# EAGLE design Flight Computer (EAGLE 6.4)
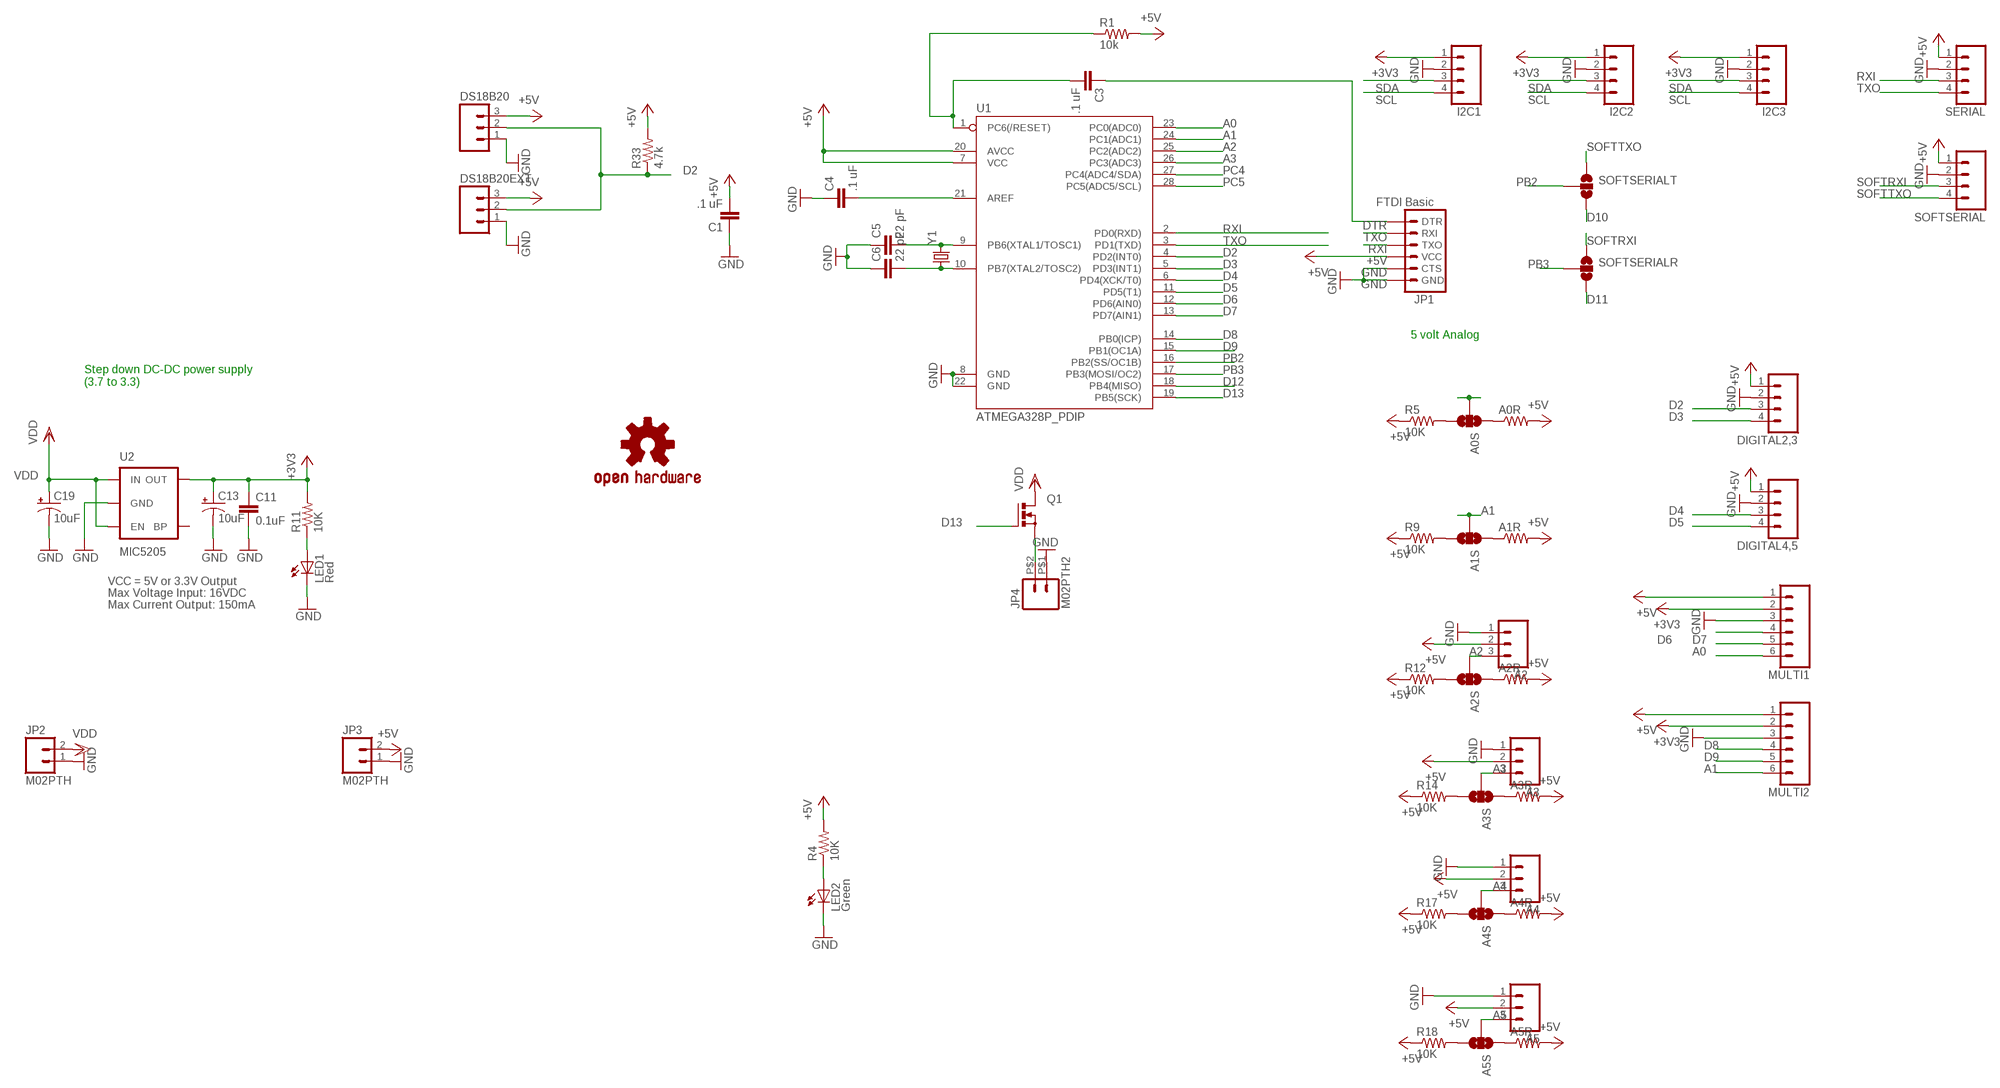
[diagram p0: schematic, sheet 1]

## Parts
A0R  RESISTORAXIAL-0.3  [AXIAL-0.3]
A0S  SOLDERJUMPER_2WAYPASTE2&3  [SJ_3_PASTE2&3]
A1R  RESISTORAXIAL-0.3  [AXIAL-0.3]
A1S  SOLDERJUMPER_2WAYPASTE2&3  [SJ_3_PASTE2&3]
A2  M03POLAR  [MOLEX-1X3]
A2R  RESISTORAXIAL-0.3  [AXIAL-0.3]
A2S  SOLDERJUMPER_2WAYPASTE2&3  [SJ_3_PASTE2&3]
A3  M03POLAR  [MOLEX-1X3]
A3R  RESISTORAXIAL-0.3  [AXIAL-0.3]
A3S  SOLDERJUMPER_2WAYPASTE2&3  [SJ_3_PASTE2&3]
A4  M03POLAR  [MOLEX-1X3]
A4R  RESISTORAXIAL-0.3  [AXIAL-0.3]
A4S  SOLDERJUMPER_2WAYPASTE2&3  [SJ_3_PASTE2&3]
A5  M03POLAR  [MOLEX-1X3]
A5R  RESISTORAXIAL-0.3  [AXIAL-0.3]
A5S  SOLDERJUMPER_2WAYPASTE2&3  [SJ_3_PASTE2&3]
C1  .1 uF  CAP1206  [1206]
C3  .1 uF  CAP1206  [1206]
C4  .1 uF  CAP1206  [1206]
C5  22 pF  CAPPTH1  [CAP-PTH-5MM]
C6  22 pF  CAPPTH1  [CAP-PTH-5MM]
C11  0.1uF  CAP1206  [1206]
C13  10uF  CAP_POL1206  [EIA3216]
C19  10uF  CAP_POL1206  [EIA3216]
DIGITAL2,3  M04POLAR  [MOLEX-1X4]
DIGITAL4,5  M04POLAR  [MOLEX-1X4]
DS18B20  M03PTH  [1X03]
DS18B20EXT  M03POLAR  [MOLEX-1X3]
I2C1  M04POLAR  [MOLEX-1X4]
I2C2  M04POLAR  [MOLEX-1X4]
I2C3  M04POLAR  [MOLEX-1X4]
JP1  FTDI Basic  ARDUINO_SERIAL_PROGRAMPTH  [1X06]
JP2  M02PTH  [1X02]
JP3  M02PTH  [1X02]
JP4  M02PTH2  [1X02_BIG]
LED1  Red  LED0603  [LED-0603]
LED2  Green  LED0603  [LED-0603]
LOGO1  OSHW-LOGOL  [OSHW-LOGO-L]
MULTI1  M06POLAR  [MOLEX-1X6]
MULTI2  M06POLAR  [MOLEX-1X6]
Q1  PMOSFET_NTO220BV  [TO220BV]
R1  10k  RESISTOR1206  [1206]
R4  10K  RESISTOR1206  [1206]
R5  10K  RESISTOR1206  [1206]
R9  10K  RESISTOR1206  [1206]
R11  10K  RESISTOR1206  [1206]
R12  10K  RESISTOR1206  [1206]
R14  10K  RESISTOR1206  [1206]
R17  10K  RESISTOR1206  [1206]
R18  10K  RESISTOR1206  [1206]
R33  4.7k  RESISTOR1206  [1206]
SERIAL  M04POLAR  [MOLEX-1X4]
SOFTSERIAL  M04POLAR  [MOLEX-1X4]
SOFTSERIALR  SOLDERJUMPER_2WAYPASTE2&3  [SJ_3_PASTE2&3]
SOFTSERIALT  SOLDERJUMPER_2WAYPASTE2&3  [SJ_3_PASTE2&3]
U1  ATMEGA328P_PDIP  [DIL28-3]
U2  MIC5205  V_REG_LDOSMD  [SOT23-5]
Y1  CRYSTALHC49UV  [HC49U-V]

## Nets
+3V3: C11.1 C13.A(+) I2C1.1 I2C2.1 I2C3.1 MULTI1.2 MULTI2.2 R11.2 U2.5(OUT)
+5V: A0R.P$2 A1R.P$2 A2.2 A2R.P$2 A3.2 A3R.P$2 A4.2 A4R.P$2 A5.2 A5R.P$2 C1.2 DIGITAL2,3.1 DIGITAL4,5.1 DS18B20.3 DS18B20EXT.3 JP1.4(VCC) JP3.2 MULTI1.1 MULTI2.1 R1.2 R4.2 R5.1 R9.1 R12.1 R14.1 R17.1 R18.1 R33.2 SERIAL.1 SOFTSERIAL.1 U1.7(VCC) U1.20(AVCC)
A0: A0S.2 MULTI1.6 U1.23(PC0(ADC0))
A1: A1S.2 MULTI2.6 U1.24(PC1(ADC1))
A2: A2.3 A2S.2 U1.25(PC2(ADC2))
A3: A3.3 A3S.2 U1.26(PC3(ADC3))
A4: A4.3 A4S.2
A5: A5.3 A5S.2
D2: DIGITAL2,3.3 DS18B20.2 DS18B20EXT.2 R33.1 U1.4(PD2(INT0))
D3: DIGITAL2,3.4 U1.5(PD3(INT1))
D4: DIGITAL4,5.3 U1.6(PD4(XCK/T0))
D5: DIGITAL4,5.4 U1.11(PD5(T1))
D6: MULTI1.4 U1.12(PD6(AIN0))
D7: MULTI1.5 U1.13(PD7(AIN1))
D8: MULTI2.4 U1.14(PB0(ICP))
D9: MULTI2.5 U1.15(PB1(OC1A))
D10: SOFTSERIALT.3
D11: SOFTSERIALR.3
D12: U1.18(PB4(MISO))
D13: Q1.G U1.19(PB5(SCK))
DTR: C3.1 JP1.1(DTR)
GND [vcc]: A2.1 A3.1 A4.1 A5.1 C1.1 C4.1 C5.1 C6.1 C11.2 C13.C(-) C19.C(-) DIGITAL2,3.2 DIGITAL4,5.2 DS18B20.1 DS18B20EXT.1 I2C1.2 I2C2.2 I2C3.2 JP1.5(CTS) JP1.6(GND) JP2.1 JP3.1 JP4.P$1 LED1.C LED2.C MULTI1.3 MULTI2.3 SERIAL.2 SOFTSERIAL.2 U1.8(GND) U1.22(GND) U2.2(GND)
N$1: C5.2 U1.9(PB6(XTAL1/TOSC1)) Y1.2
N$2: C6.2 U1.10(PB7(XTAL2/TOSC2)) Y1.1
N$3: LED2.A R4.1
N$4: A0S.3 R5.2
N$5: C4.2 U1.21(AREF)
N$6: JP4.P$2 Q1.S
N$7: C3.2 R1.1 U1.1(PC6(/RESET))
N$10: A1S.3 R9.2
N$12: A2S.3 R12.2
N$14: A3S.3 R14.2
N$17: A4S.3 R17.2
N$18: A5S.3 R18.2
N$20: A5R.P$1 A5S.1
N$23: A4R.P$1 A4S.1
N$24: A3R.P$1 A3S.1
N$27: A2R.P$1 A2S.1
N$29: A1R.P$1 A1S.1
N$30: A0R.P$1 A0S.1
N$38: LED1.A R11.1
PB2: SOFTSERIALT.2 U1.16(PB2(SS/OC1B))
PB3: SOFTSERIALR.2 U1.17(PB3(MOSI/OC2))
PC4: U1.27(PC4(ADC4/SDA))
PC5: U1.28(PC5(ADC5/SCL))
RXI: JP1.3(TXO) SERIAL.3 U1.2(PD0(RXD))
SCL: I2C1.4 I2C2.4 I2C3.4
SDA: I2C1.3 I2C2.3 I2C3.3
SOFTRXI: SOFTSERIAL.3 SOFTSERIALR.1
SOFTTXO: SOFTSERIAL.4 SOFTSERIALT.1
TXO: JP1.2(RXI) SERIAL.4 U1.3(PD1(TXD))
VDD: C19.A(+) JP2.2 Q1.D U2.1(IN) U2.3(EN)
Unconnected: U2.4(BP)

## Notes on the sheet
- 5 volt Analog
- Step down DC-DC power supply
  (3.7 to 3.3)
- VCC = 5V or 3.3V Output
- Max Voltage Input: 16VDC
- Max Current Output: 150mA

## Library data of the parts
A0R A1R A2R A3R A4R A5R R1 R5 R9 R12 R14 R17 R18 R33 = SparkFun-Passives:RESISTOR: Resistor Basic schematic elements and footprints for 0603, 1206, and PTH resistors.
A0S A1S A2S A3S A4S A5S SOFTSERIALR SOFTSERIALT = SparkFun:SOLDERJUMPER_2WAY: Solder Jumper 2 way solder jumper
A2-A5 DS18B20 DS18B20EXT = SparkFun-Connectors:M03: Header 3 Standard 3-pin 0.1" header. Use with straight break away headers (SKU : PRT-00116), right angle break away headers (PRT-00553), swiss pins (PRT-00743), machine pins (PRT-00117), and female headers (PRT-00115). Molex polarized connector foot print use with SKU : PRT-08232 with associated crimp pins and housings.
C1 C3-C6 = SparkFun-Passives:CAP: Capacitor Standard 0603 ceramic capacitor, and 0.1" leaded capacitor.
C11 = SparkFun:CAP: Capacitor Standard 0603 ceramic capacitor, and 0.1" leaded capacitor.
C13 C19 = SparkFun:CAP_POL: Capacitor Polarized These are standard SMD and PTH capacitors. Normally 10uF, 47uF, and 100uF in electrolytic and tantalum varieties. Always verify the external diameter of the through hole cap, it varies with capacity, voltage, and manufacturer. The EIA devices should be standard.
DIGITAL2,3 DIGITAL4,5 I2C1-I2C3 SERIAL SOFTSERIAL = SparkFun-Connectors:M04: Header 4 Standard 4-pin 0.1" header. Use with straight break away headers (SKU : PRT-00116), right angle break away headers (PRT-00553), swiss pins (PRT-00743), machine pins (PRT-00117), and female headers (PRT-00115). Molex polarized connector foot print use with SKU : PRT-08231 with associated crimp pins and housings. 1MM SMD Version SKU: PRT-10208
JP1 = SparkFun:ARDUINO_SERIAL_PROGRAM
JP2-JP4 = SparkFun-Connectors:M02: Standard 2-pin 0.1" header. Use with - straight break away headers ( PRT-00116) - right angle break away headers (PRT-00553) - swiss pins (PRT-00743) - machine pins (PRT-00117) - female headers (PRT-00115) Molex polarized connector foot print use with: PRT-08233 with associated crimp pins and housings. 2.54_SCREWTERM for use with PRT-10571. 3.5mm Screw Terminal footprints for PRT-08084 5mm Screw Terminal footprints for use with PRT-08433
LED1 LED2 = SparkFun:LED: LEDs Standard schematic elements and footprints for 5mm, 3mm, 1206, and 0603 sized LEDs. 5mm - Spark Fun Electronics SKU : COM-00529 (and others)
LOGO1 = SparkFun-Aesthetics:OSHW-LOGO: Open Source Hardware Logo This logo indicates the piece of hardware it is found on incorporates a OSHW license and/or adheres to the definition of open source hardware found here: http://freedomdefined.org/OSHW
MULTI1 MULTI2 = SparkFun-Connectors:M06: Header 6 Standard 6-pin 0.1" header. Use with straight break away headers (SKU : PRT-00116), right angle break away headers (PRT-00553), swiss pins (PRT-00743), machine pins (PRT-00117), and female headers (PRT-00115). Molex polarized connector foot print use with SKU : PRT-08094 with associated crimp pins and housings. NOTES ON THE VARIANTS LOCK and LOCK_LONGPADS... This footprint was designed to help hold the alignment of a through-hole component (i.e. 6-pin header) while soldering it into place. You may notice that each hole has been shifted either up or down by 0.005 of an inch from it's more standard position (which is a perfectly straight line). This slight alteration caused the pins (the squares in the middle) to touch the edges of the holes. Because they are alternating, it causes a "brace" to hold the component in place. 0.005 has proven to be the perfect amount of "off-center" position when using our standard breakaway headers. Although looks a little odd when you look at the bare footprint, once you have a header in there, the alteration is very hard to notice. Also,if you push a header all the way into place, it is covered up entirely on the bottom side. This idea of altering the position of holes to aid alignment will be further integrated into the Sparkfun Library for other footprints. It can help hold any component with 3 or more connection pins.
Q1 = transistor-power:PMOSFET_N: Power MOSFET N-Channel
R4 R11 = SparkFun:RESISTOR: Resistor Basic schematic elements and footprints for 0603, 1206, and PTH resistors.
U1 = SparkFun-DigitalIC:ATMEGA328P_PDIP: uC used in the Arduino 32kb flash, 1k EEPROM, 2k SRAM This is the through-hole version of this chip.
U2 = SparkFun:V_REG_LDO: Voltage Regulator LDO Standard 150mA LDO voltage regulator in SOT-23 layout. Micrel part MIC5205. BP (by-pass) pin is used to lower output noise with 470pF cap.
Y1 = SparkFun-FreqCtrl:CRYSTAL: Various standard crystals. Proven footprints. Spark Fun Electronics SKU : COM-00534

## Net classes
1 vcc: width 0.254 mm

## Board
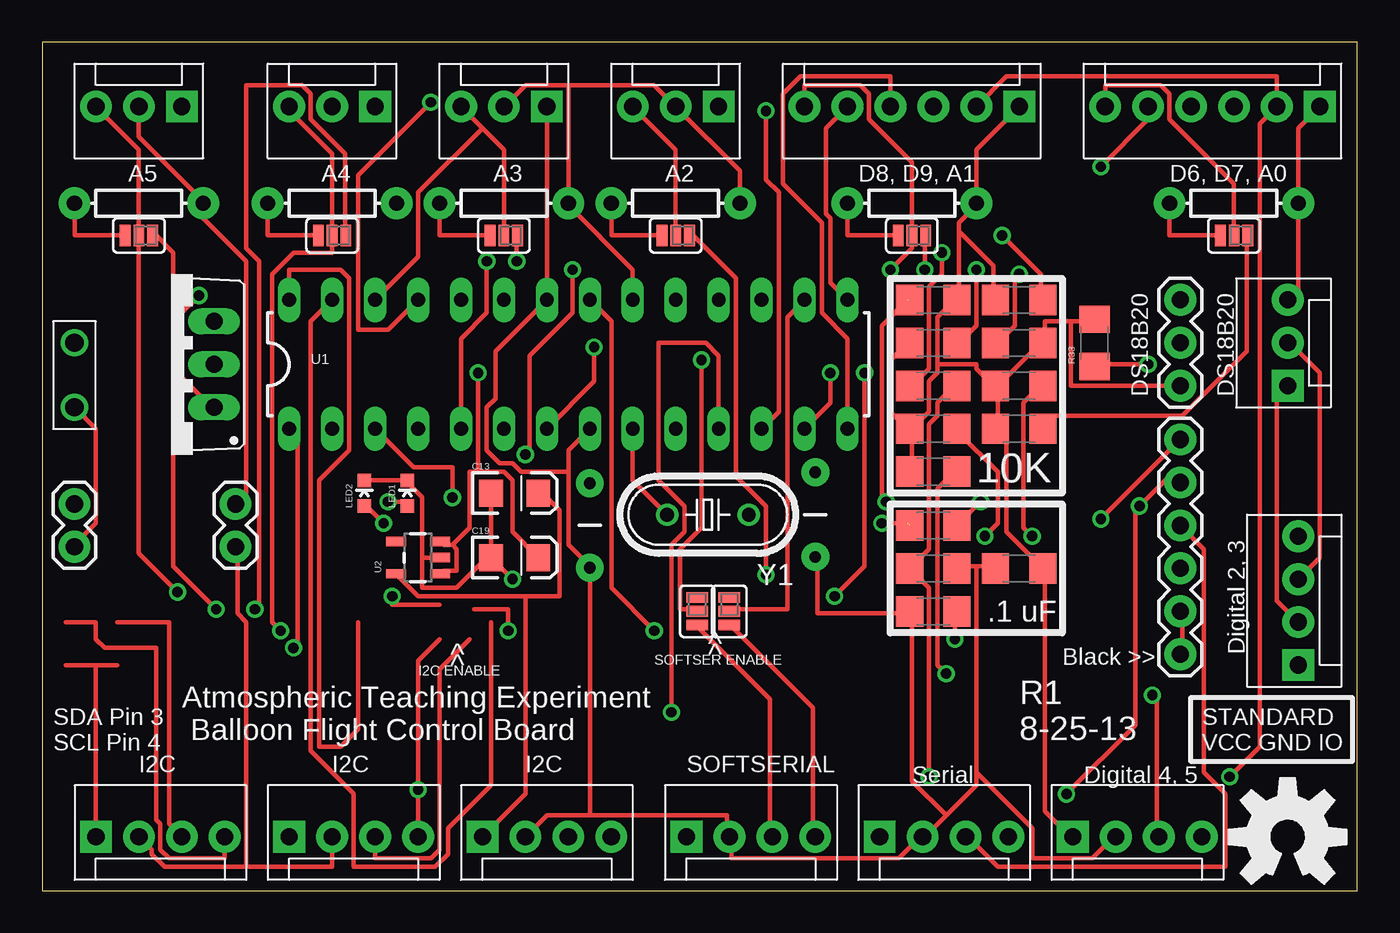
[diagram p1: board, top side]
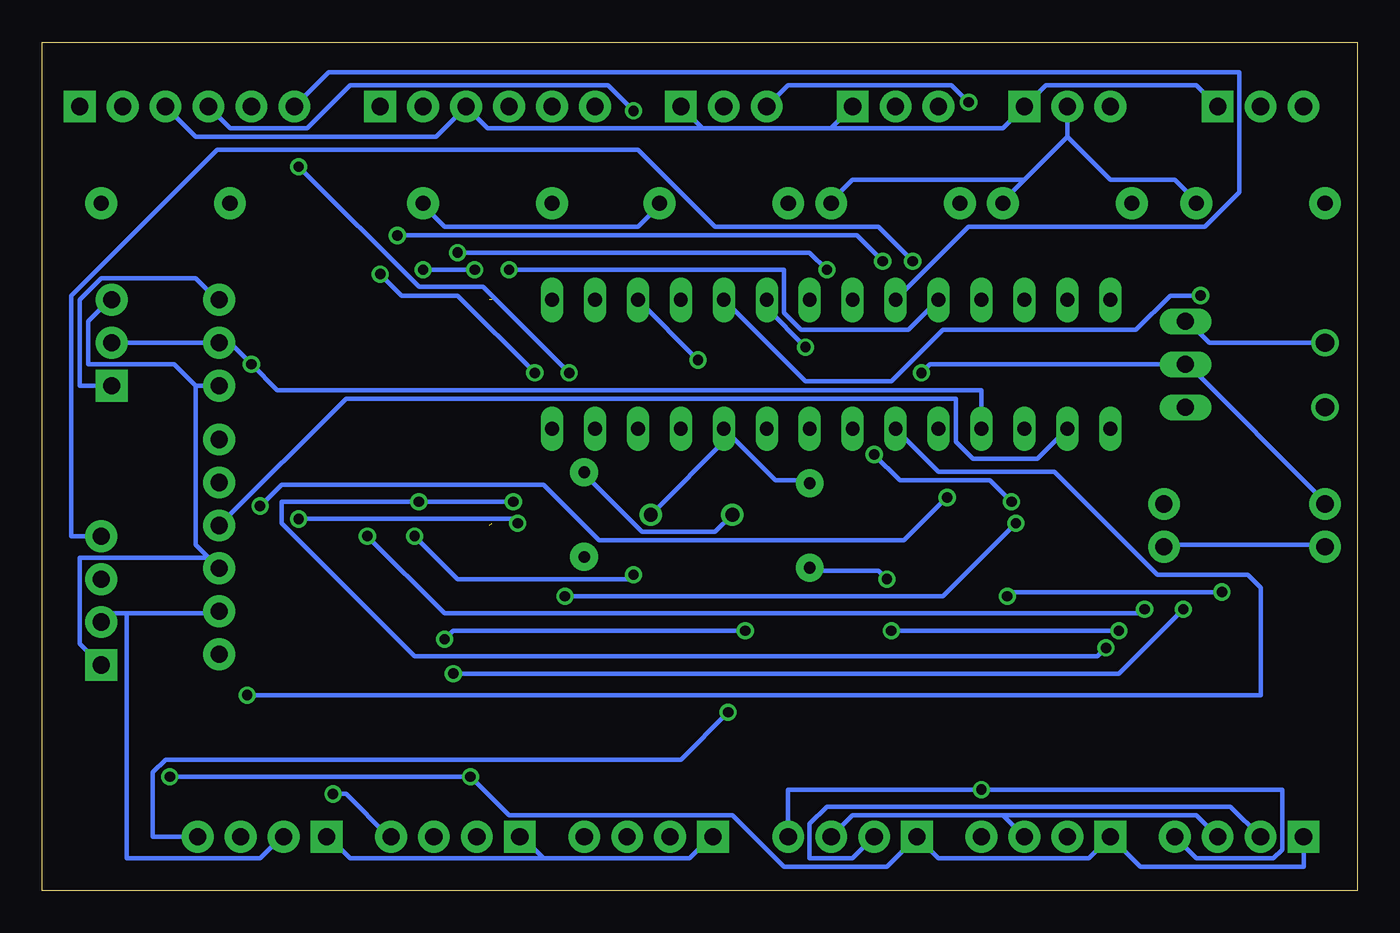
[diagram p2: board, bottom side, seen from below]

Size 77.78 x 50.16 mm. Coordinates in mm from the lower left corner, seen from the top.
Outline: 0,0 77.78,0 77.78,50.16 0,50.16 0,0
Copper layers (1*16): Top 0.035mm / dielectric 1.5mm / Bottom 0.035mm
Design rules "default": minimum track width 10mil, minimum drill 24mil, track to track 8mil, track to pad 8mil, pad to pad 8mil, via to via 8mil, smd to smd 8mil, copper to edge 40mil, drill to drill 8mil, minimum pad ring 10mil, minimum via ring 8mil, stop-mask expansion 4mil, vias tented up to drill 0mil, thermal gap 10mil

### Footprints (pad centres in the part's own frame; a part is rotated, then mirrored left to right if it is on the bottom)
AXIAL-0.3 = drill 0.9 pad 1.88: P$1 -3.81,0; P$2 3.81,0
SJ_3_PASTE2&3 = smd 0.635 x 1.27: 1 -0.813,0; 2 0,0; 3 0.813,0
MOLEX-1X3 = drill 1.016 pad 1.88 square: 1 0,0 | drill 1.016 pad 1.88: 2 2.54,0; 3 5.08,0
1206 = smd 1.6 x 1.8: 1 -1.4,0; 2 1.4,0
CAP-PTH-5MM = drill 0.7 pad 1.651: 1 -2.5,0; 2 2.5,0
EIA3216 = smd 1.4 x 1.6: A 1.4,0; C -1.4,0
MOLEX-1X4 = drill 1.016 pad 1.88 square: 1 0,0 | drill 1.016 pad 1.88: 2 2.54,0; 3 5.08,0; 4 7.62,0
1X03 = drill 1.016 pad 1.88: 1 0,0; 2 2.54,0; 3 5.08,0
1X06 = drill 1.016 pad 1.88: 1 0,0; 2 2.54,0; 3 5.08,0; 4 7.62,0; 5 10.16,0; 6 12.7,0
1X02 = drill 1.016 pad 1.88: 1 0,0; 2 2.54,0
1X02_BIG = drill 1.067: P$1 0,0; P$2 3.81,0
LED-0603 = smd 0.8 x 0.8: A 0,-0.75; C 0,0.75
MOLEX-1X6 = drill 1.016 pad 1.88 square: 1 0,0 | drill 1.016 pad 1.88: 2 2.54,0; 3 5.08,0; 4 7.62,0; 5 10.16,0; 6 12.7,0
TO220BV = drill 1.016 long: D 0,-2.54; G -2.54,-2.54; S 2.54,-2.54
DIL28-3 = drill 0.813 long: 1 -16.51,-3.81; 2 -13.97,-3.81; 3 -11.43,-3.81; 4 -8.89,-3.81; 5 -6.35,-3.81; 6 -3.81,-3.81; 7 -1.27,-3.81; 8 1.27,-3.81; 9 3.81,-3.81; 10 6.35,-3.81; 11 8.89,-3.81; 12 11.43,-3.81; 13 13.97,-3.81; 14 16.51,-3.81; 15 16.51,3.81; 16 13.97,3.81; 17 11.43,3.81; 18 8.89,3.81; 19 6.35,3.81; 20 3.81,3.81; 21 1.27,3.81; 22 -1.27,3.81; 23 -3.81,3.81; 24 -6.35,3.81; 25 -8.89,3.81; 26 -11.43,3.81; 27 -13.97,3.81; 28 -16.51,3.81
SOT23-5 = smd 0.55 x 1.2: 1 -0.95,-1.3; 2 0,-1.3; 3 0.95,-1.3; 4 0.95,1.3; 5 -0.95,1.3
HC49U-V = drill 0.813: 1 -2.413,0; 2 2.413,0

### Placement (x,y rotation side)
A0R  70.48,40.64 0 top
A0S  70.48,38.73 0 top
A1R  51.43,40.64 0 top
A1S  51.43,38.73 0 top
A2  40,46.36 180 top
A2R  37.46,40.64 0 top
A2S  37.46,38.73 0 top
A3  29.85,46.36 180 top
A3R  27.31,40.64 0 top
A3S  27.31,38.73 0 top
A4  19.69,46.36 180 top
A4R  17.15,40.64 0 top
A4S  17.15,38.73 0 top
A5  8.26,46.36 180 top
A5R  5.71,40.64 0 top
A5S  5.71,38.73 0 top
C1  57.78,19.05 0 top
C3  52.7,21.59 0 top
C4  52.7,16.51 0 top
C5  45.72,22.23 90 top
C6  32.38,21.59 90 top
C11  52.7,19.05 0 top
C13  27.94,23.5 0 top
C19  27.94,19.69 0 top
DIGITAL2,3  74.3,13.34 90 top
DIGITAL4,5  60.96,3.18 0 top
DS18B20  67.31,34.92 270 top
DS18B20EXT  73.66,29.84 90 top
I2C1  26.04,3.18 0 top
I2C2  14.61,3.18 0 top
I2C3  3.17,3.18 0 top
JP1  67.31,26.67 270 top
JP2  1.91,20.32 90 top
JP3  11.43,20.32 90 top
JP4  1.91,28.58 90 top
LED1  21.59,23.5 0 top
LED2  19.05,23.5 0 top
LOGO1  73.66,3.18 0 top
MULTI1  75.57,46.36 180 top
MULTI2  57.78,46.36 180 top
Q1  7.62,31.12 90 top
R1  52.7,34.92 0 top
R4  57.78,32.38 0 top
R5  57.78,27.3 0 top
R9  52.7,32.38 0 top
R11  52.7,29.84 0 top
R12  52.7,27.3 0 top
R14  57.78,34.92 0 top
R17  57.78,29.84 0 top
R18  52.7,24.77 0 top
R33  62.23,32.38 90 top
SERIAL  49.53,3.18 0 top
SOFTSERIAL  38.1,3.18 0 top
SOFTSERIALR  38.73,16.51 90 top
SOFTSERIALT  40.64,16.51 90 top
U1  31.12,31.12 0 top
U2  22.23,19.69 90 top
Y1  39.37,22.23 180 top

### Tracks (layer width: path | path; a pad name or v marks a point on that pad's centre or on a via)
+3V3  (via drill 0.61)
  Top 0.254: MULTI2.2 57.02,48.13 73.03,48.13 MULTI1.2 72.01,45.34 72.01,8.51 v70.23,6.73 | 4.45,13.34 3.17,13.34 | 3.17,13.34 1.4,13.34 | I2C3.1 3.17,13.34 | R11.2 53.98,29.84 52.96,28.83 52.96,28.07 52.45,27.56 52.45,20.19 51.43,19.18 C11.1 51.43,18.92 52.45,17.91 v52.45,6.73 | 28.58,17.4 30.61,17.4 30.61,22.48 29.59,23.5 C13.A | 28.58,17.4 22.23,17.4 20.96,18.67 U2.5 | 28.58,17.4 28.58,5.72 I2C1.1
  Bottom 0.254: I2C3.1 3.17,1.4 12.83,1.4 I2C2.1 15.88,1.91 24.77,1.91 I2C1.1 27.81,1.4 33.91,1.4 36.96,4.45 50.16,4.45 v52.45,6.73 v70.23,6.73
+5V  (via drill 0.61)
  Top 0.254: A2R.P$2 41.27,42.55 A2.2 36.2,47.62 31.12,47.62 | U1.7 32.64,30.1 v32.64,32.13 | U1.20 34.92,36.7 31.12,40.51 A3R.P$2 31.12,47.62 | A3.2 28.58,47.62 31.12,47.62 | A5.2 5.71,44.58 9.53,40.77 A5R.P$2 9.53,39.75 12.06,37.21 12.06,23.5 JP3.2 | DS18B20EXT.3 73.79,34.92 74.3,35.43 A0R.P$2 74.3,45.09 MULTI1.1 | 56.52,29.84 56.52,27.3 | 56.52,27.3 57.02,26.8 57.02,21.21 59.05,19.18 C1.2 59.31,18.92 59.31,4.7 60.83,3.18 DIGITAL4,5.1 | 56.52,27.3 R5.1 | 56.52,29.84 59.05,32.38 R4.2 59.31,32.38 59.31,33.66 60.83,33.66 | 56.52,29.84 R17.1 56.26,29.84 55.24,30.86 55.24,31.12 52.96,31.12 | 60.83,33.66 62.1,33.66 R33.2 | 51.43,27.3 51.43,24.77 R18.1 | R9.1 51.18,32.38 50.16,31.37 50.16,28.32 51.18,27.3 R12.1 51.43,27.3 | 54.23,38.99 54.23,39.5 55.24,40.51 A1R.P$2 55.24,43.81 MULTI2.1 | 54.23,38.99 54.23,34.92 R1.2 53.98,34.92 52.96,33.91 52.96,31.12 | 54.23,38.99 56.26,36.96 56.26,34.92 R14.1 | 51.43,27.3 52.45,28.32 52.45,30.1 52.96,30.61 52.96,31.12 | DS18B20.3 60.83,29.84 60.83,33.66
  Bottom 0.254: v32.64,32.13 34.92,34.42 U1.20 | 17.15,44.58 19.69,42.04 | 19.69,42.04 20.96,40.77 A4R.P$2 | A4.2 17.15,44.58 | 17.15,44.58 14.61,42.04 10.79,42.04 9.53,40.77 A5R.P$2 | 19.69,42.04 29.85,42.04 31.12,40.77 A3R.P$2 | 67.95,19.69 68.71,20.45 68.71,29.84 | 67.95,19.69 JP1.4 67.44,19.18 | DS18B20.3 68.71,29.84 | DIGITAL2,3.1 75.57,14.61 75.57,19.69 67.95,19.69 | 68.71,29.84 69.98,31.12 75.06,31.12 75.06,33.66 73.79,34.92 DS18B20EXT.3 | 48.13,1.91 39.5,1.91 38.23,3.18 SOFTSERIAL.1 | 48.13,1.91 49.4,3.18 SERIAL.1 | 48.13,1.91 59.56,1.91 60.83,3.18 DIGITAL4,5.1 | A2R.P$2 41.27,40.51 42.54,39.24 53.98,39.24 55.24,40.51 A1R.P$2
A0
  Top 0.254: A0S.2 70.48,41.78 66.68,45.59 66.68,47.12 66.17,47.62 62.86,47.62 MULTI1.6
  Bottom 0.254: U1.23 22.99,39.24 9.02,39.24 6.98,41.28 6.98,48.39 60.83,48.39 MULTI1.6
A1  (via drill 0.61)
  Top 0.254: MULTI2.6 45.09,47.62 48.39,47.62 48.89,47.12 48.89,45.59 51.43,43.05 A1S.2 51.43,37.97 v50.16,36.7
  Bottom 0.254: U1.24 26.54,33.15 32.89,33.15 33.91,34.16 33.91,36.7 v50.16,36.7
A2  (via drill 0.61)
  Top 0.254: A2S.2 37.46,43.81 A2.3 | U1.25 20.45,33.15 18.67,33.15 18.67,42.29 v22.99,46.61
  Bottom 0.254: v22.99,46.61 24,47.62 33.66,47.62 A2.3
A3
  Top 0.254: A3S.2 27.31,43.81 26.04,45.09 | A3.3 26.04,45.09 | U1.26 22.23,37.47 22.23,41.28 26.04,45.09
A4  (via drill 0.61)
  Top 0.254: A4.3 14.61,46.1 17.15,43.56 A4S.2 17.15,37.72 14.86,37.72 13.59,36.45 13.59,15.88 v14.1,15.37 | 25.53,16.64 27.56,16.64 v27.56,15.37
  Bottom 0.254: v14.1,15.37 v27.56,15.37
A5  (via drill 0.61)
  Top 0.254: A5.3 5.71,43.81 A5S.2 5.71,19.94 v8,17.65 | 23.5,16.89 20.7,16.89 v20.7,17.4
  Bottom 0.254: v20.7,17.4 20.45,17.65 v8,17.65
D2  (via drill 0.61)
  Top 0.254: v65.41,31.12 62.36,31.12 R33.1 | DIGITAL2,3.3 75.57,19.69 75.57,30.61 73.79,32.38 DS18B20EXT.2
  Bottom 0.254: U1.4 22.23,29.59 63.88,29.59 v65.41,31.12 66.68,32.38 DS18B20.2 DS18B20EXT.2
D3  (via drill 0.61)
  Top 0.254: U1.5 24.77,32.64 26.29,34.16 v26.29,37.21
  Bottom 0.254: v26.29,37.21 28.32,39.24 37.97,39.24 42.54,43.81 67.44,43.81 76.07,35.18 76.07,20.95 DIGITAL2,3.4
D4  (via drill 0.61)
  Top 0.254: v65.66,11.56 65.91,11.3 65.91,3.18 DIGITAL4,5.3
  Bottom 0.254: U1.6 24.77,24.77 17.91,24.77 11.81,18.67 6.48,18.67 5.71,17.91 5.71,11.56 v65.66,11.56
D5  (via drill 0.61)
  Top 0.254: U1.11 40,31.62 39.24,32.38 36.45,32.38 36.45,24.26 37.97,22.73 37.97,21.21 37.21,20.45 v37.21,10.54
  Bottom 0.254: v37.21,10.54 40,7.75 70.48,7.75 71.25,6.98 71.25,3.18 DIGITAL4,5.4
D6  (via drill 0.61)
  Top 0.254: U1.12 43.56,28.32 43.56,41.28 42.8,42.04 v42.8,46.1
  Bottom 0.254: v42.8,46.1 44.32,47.62 59.56,47.62 62.1,45.09 66.68,45.09 MULTI1.4
D7  (via drill 0.61)
  Top 0.254: U1.13 46.61,28.83 v46.61,30.61 | v62.61,42.8 65.41,45.59 MULTI1.5
  Bottom 0.254: v46.61,30.61 51.69,35.69 55.5,35.69 v62.61,42.8
D8
  Top 0.254: U1.14 47.62,32.64 46.1,34.16 46.1,39.5 43.81,41.78 43.81,47.12 44.83,48.13 50.16,48.13 MULTI2.4
D9
  Top 0.254: U1.15 46.61,35.94 46.61,39.75 46.35,40 46.35,45.09 MULTI2.5
D13  (via drill 0.61)
  Top 0.254: v9.27,35.18 8.26,34.16 8.26,30.35 10.03,28.58 Q1.G
  Bottom 0.254: U1.19 32.64,30.1 27.56,30.1 24.51,33.15 13.08,33.15 11.05,35.18 v9.27,35.18
DTR  (via drill 0.61)  (1 unrouted)
  Top 0.254: v49.66,21.72 51.18,21.72 | JP1.1 v62.61,21.97
  Bottom 0.254: v49.66,21.72 49.91,21.97 v62.61,21.97
GND  (via drill 0.61)
  Top 0.254: A3.1 U1.22 26.8,31.88 26.8,29.08 26.29,28.58 26.29,26.04 27.05,25.27 27.81,25.27 28.32,24.77 31.12,24.77 | JP1.6 67.44,14.1 67.44,16.38 JP1.5 | DIGITAL2,3.2 73.03,17.15 73.03,29.34 73.53,29.84 DS18B20EXT.1 | C5.1 45.85,19.69 45.85,16.38 51.18,16.38 C4.1 51.43,16.38 51.43,6.48 53.47,4.45 | 55.24,19.18 56.26,19.18 C1.1 | 55.24,19.18 54.23,19.18 C11.2 | 55.24,6.98 55.24,6.22 53.47,4.45 | 55.24,6.98 55.24,19.18 | 53.47,4.45 52.2,3.18 SERIAL.2 51.94,3.18 50.67,1.91 40.77,1.91 40.77,3.18 SOFTSERIAL.2 40.51,3.18 40.51,4.45 32.38,4.45 | 55.24,6.98 58.55,3.68 58.55,1.91 62.1,1.91 63.37,3.18 DIGITAL4,5.2 | I2C3.2 6.48,2.41 6.48,2.16 7.24,1.4 12.06,1.4 | 12.06,1.4 17.15,1.4 I2C2.2 | JP4.P$1 3.17,27.3 3.17,21.72 1.91,20.45 JP2.1 | 12.06,1.4 12.06,15.88 11.56,16.38 11.56,20.19 JP3.1 | I2C1.2 29.85,4.45 32.38,4.45 | C19.C C13.C | LED2.C 19.18,24.26 21.46,24.26 LED1.C 21.72,24 22.48,23.24 22.48,19.69 | 22.48,19.69 U2.2 | 22.48,19.69 22.48,17.91 24.51,17.91 26.29,19.69 C19.C | U1.8 31.12,26.04 31.12,24.77 | 31.12,24.77 31.12,20.45 32.38,19.18 C6.1 32.38,4.45 | v27.81,18.41 C19.C
  Bottom 0.254: A5.1 9.53,47.62 18.42,47.62 A4.1 20.96,45.09 31.12,45.09 | 38.73,45.09 A2.1 | 31.12,45.09 38.73,45.09 | A3.1 31.12,45.09 | 38.73,45.09 51.43,45.09 MULTI2.3 54.48,44.58 68.71,44.58 MULTI1.3 | DIGITAL2,3.2 73.79,16.38 72.77,16.38 | 72.77,16.38 67.44,16.38 JP1.5 | DS18B20EXT.1 75.57,29.84 75.57,34.92 74.3,36.2 68.71,36.2 67.44,34.92 DS18B20.1 | 72.77,16.38 72.77,1.91 64.9,1.91 63.63,3.18 DIGITAL4,5.2 | JP3.1 11.3,20.45 1.91,20.45 JP2.1 | v27.81,18.41 28.32,18.92 32.38,18.92 C6.1 | I2C3.2 7.49,4.95 31.37,4.95 32.38,3.94 32.38,1.91 29.85,1.91 I2C1.2
N$1
  Top 0.254: Y1.2 34.92,24.26 U1.9
  Bottom 0.254: Y1.2 37.97,21.21 42.29,21.21 45.59,24.51 C5.2
N$2
  Bottom 0.254: 36.96,26.8 34.42,24.26 32.38,24.26 C6.2 | Y1.1 37.21,26.8 36.96,26.8 | 36.96,26.8 U1.10
N$3  (via drill 0.61)
  Top 0.254: v20.19,21.72 19.18,22.73 LED2.A | v46.86,17.4 48.64,19.18 v48.64,30.61 | v57.78,36.45 57.53,36.2 57.53,33.4 56.52,32.38 R4.1
  Bottom 0.254: v20.19,21.72 24.51,17.4 v46.86,17.4 | v48.64,30.61 53.21,35.18 56.52,35.18 v57.78,36.45
N$4
  Top 0.254: A0S.3 71.25,38.73 71.25,31.88 67.44,28.07 59.31,28.07 59.31,27.3 R5.2
N$5  (via drill 0.61)
  Top 0.254: v53.98,14.86 53.98,16.38 C4.2 | v36.2,15.37 33.66,17.91 33.66,33.66 U1.21
  Bottom 0.254: v53.98,14.86 53.47,15.37 v36.2,15.37
N$6
  Bottom 0.254: JP4.P$2 8.76,32.38 10.03,33.66 Q1.S
N$7  (via drill 0.61)  (1 unrouted)
  Top 0.254: v55.5,22.99 54.23,21.72 C3.2 | v49.91,22.99 49.66,23.24 49.66,33.4 51.18,34.92 | U1.1 15.11,26.8 15.11,14.61 v14.86,14.35
  Bottom 0.254: v49.91,22.99 v55.5,22.99 63.63,22.99 63.63,21.72 55.75,13.84 15.37,13.84 v14.86,14.35
N$10  (via drill 0.61)
  Top 0.254: v52.2,36.7 52.2,38.73 A1S.3 | v55.24,36.7 55.24,33.4 54.23,32.38 R9.2
  Bottom 0.254: v55.24,36.7 v52.2,36.7
N$12  (via drill 0.61)
  Top 0.254: v42.8,18.67 42.8,22.73 41.02,24.51 41.02,36.2 38.48,38.73 A2S.3 | v55.75,20.95 56.52,21.72 56.52,24.77 54.23,27.05 54.23,27.3 R12.2
  Bottom 0.254: v42.8,18.67 43.05,18.41 53.21,18.41 v55.75,20.95
N$14  (via drill 0.61)
  Top 0.254: v28.07,37.21 28.07,38.73 A3S.3 | v56.77,38.73 59.05,36.45 59.05,34.92 R14.2
  Bottom 0.254: v28.07,37.21 29.59,38.73 v56.77,38.73
N$17  (via drill 0.61)
  Top 0.254: v12.57,16.64 12.83,16.89 12.83,37.21 12.06,37.97 12.06,47.62 15.37,47.62 15.88,47.12 15.88,45.59 17.91,43.56 17.91,38.73 A4S.3 | v58.55,20.95 58.04,21.46 58.04,28.83 59.05,29.84 R17.2
  Bottom 0.254: v12.57,16.64 12.83,16.38 53.98,16.38 v58.55,20.95
N$18  (via drill 0.61)
  Top 0.254: v10.29,16.64 7.75,19.18 7.75,37.72 6.73,38.73 A5S.3 | v53.47,12.83 52.96,13.34 52.96,23.75 53.98,24.77 R18.2
  Bottom 0.254: v10.29,16.64 14.1,12.83 v53.47,12.83
N$20
  Top 0.254: A5S.1 1.91,38.73 A5R.P$1
N$23
  Top 0.254: A4S.1 13.33,38.73 A4R.P$1
N$24
  Top 0.254: A3S.1 23.5,38.73 A3R.P$1
N$27
  Top 0.254: A2S.1 33.66,38.73 A2R.P$1
N$29
  Top 0.254: A1S.1 47.62,38.73 A1R.P$1
N$30
  Top 0.254: A0S.1 66.68,38.73 A0R.P$1
N$38  (via drill 0.61)
  Top 0.254: v20.45,22.99 21.46,22.99 LED1.A | v28.58,25.78 28.83,26.04 28.83,31.62 31.37,34.16 v31.37,36.7 | v53.21,37.72 53.21,36.45 52.45,35.69 52.45,30.86 51.43,29.84 R11.1
  Bottom 0.254: v20.45,22.99 21.72,24.26 27.05,24.26 v28.58,25.78 | v31.37,36.7 32.38,37.72 v53.21,37.72
PB2
  Top 0.254: U1.16 44.07,33.91 44.07,16.64 40.77,16.64 SOFTSERIALT.2
PB3  (via drill 0.61)
  Top 0.254: v38.99,31.37 38.99,21.46 37.72,20.19 37.72,16.64 38.73,16.64 SOFTSERIALR.2
  Bottom 0.254: U1.17 v38.99,31.37
PC4
  Top 0.254: 26.54,15.88 26.54,6.22 24,3.68 24,2.16 23.24,1.4 18.42,1.4 18.42,5.72 15.88,8.26 15.88,33.66 U1.27
PC5
  Top 0.254: 18.67,15.88 18.67,9.52 17.65,8.51 16.38,8.51 16.38,24.26 18.16,26.04 18.16,36.2 17.65,36.7 14.61,36.7 U1.28
RXI
  Top 0.254: JP1.3 68.71,20.19 68.71,6.98 69.98,5.72 69.98,1.4 56.52,1.4 54.74,3.18 SERIAL.3
  Bottom 0.254: U1.2 18.92,25.53 22.73,25.53 23.75,26.54 23.75,29.08 59.82,29.08 JP1.3
SCL  (via drill 0.61)
  Top 0.254: 1.4,15.88 3.17,15.88 3.17,14.86 3.68,14.35 6.73,14.35 6.73,4.19 6.98,3.94 6.98,2.41 7.49,1.91 10.79,1.91 I2C3.4 | 23.5,14.86 22.23,13.59 v22.23,5.97 I2C2.4
  Bottom 0.254: I2C1.4 33.66,5.97 v22.23,5.97 4.45,5.97 4.45,2.41 4.95,1.91 9.53,1.91 I2C3.4
SDA
  Top 0.254: 4.45,15.88 7.49,15.88 7.49,3.94 I2C3.3 | 25.27,14.86 23.5,13.08 23.5,2.41 22.99,1.91 19.69,1.91 I2C2.3
  Bottom 0.254: I2C1.3 29.85,4.45 20.96,4.45 | I2C2.3 20.96,4.45 | I2C3.3 9.53,4.45 20.96,4.45
SOFTRXI
  Top 0.254: SOFTSERIALR.1 38.73,15.62 43.05,11.3 43.05,3.18 SOFTSERIAL.3
SOFTTXO
  Top 0.254: SOFTSERIALT.1 40.77,15.62 45.59,10.8 45.59,3.18 SOFTSERIAL.4
TXO  (via drill 0.61)
  Top 0.254: U1.3 21.97,25.02 24.26,25.02 v24.26,23.24 | JP1.2 67.18,24.26 66.42,24.26 v64.9,22.73 64.64,22.48 64.64,9.78 v60.58,5.72
  Bottom 0.254: v24.26,23.24 26.8,20.7 44.83,20.7 48.13,24 63.63,24 v64.9,22.73 | v60.58,5.72 59.82,5.72 57.28,3.18 SERIAL.4
VDD  (via drill 0.61)
  Top 0.254: 24.26,20.45 24.51,20.19 24.51,18.92 23.75,18.92 U2.1 | 24.26,20.45 23.75,20.45 U2.3 | 25.78,24.77 25.27,24.77 25.27,21.46 24.26,20.45 | 25.78,24.77 27.31,24.77 27.81,24.26 27.81,21.21 C19.A | v25.78,30.61 25.78,24.77
  Bottom 0.254: JP2.2 1.91,22.99 10.03,31.12 Q1.D 25.27,31.12 v25.78,30.61

### Text on the board
tNames: A5 | A4 | A3 | A2 | D8, D9, A1 | D6, D7, A0 | DS18B20 | DS18B20 | 10K | .1 uF | Digital 2, 3 | I2C ENABLE | SOFTSER ENABLE | Black >> | ^ | ^ | ^ | ^ | Atmospheric Teaching Experiment / Balloon Flight Control Board | R1 / 8-25-13 | SDA Pin 3 / SCL Pin 4 | STANDARD / VCC GND IO | I2C | I2C | I2C | SOFTSERIAL | Serial | Digital 4, 5